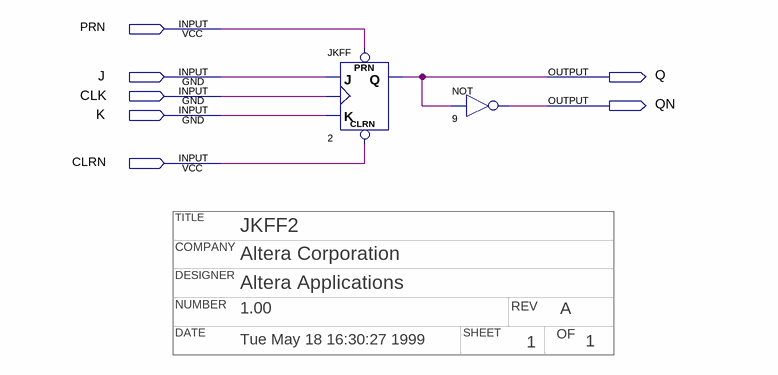
[diagram p0: schematic sheet]
// Quartus schematic jkff2.bdf as structural Verilog: 2 symbols, 7 pins
// Title block: TITLE: JKFF2; COMPANY: Altera Corporation; DESIGNER: Altera Applications; NUMBER: 1.00; REV: A; DATE: Tue May 18 16:30:27 1999; SHEET: 1; OF: 1
module jkff2 (
  input  PRN,
  input  J,
  input  CLK,
  input  K,
  input  CLRN,
  output Q,
  output QN
);

  JKFF u_2 (.PRN(PRN), .CLRN(CLRN), .K(K), .J(J), .CLK(CLK), .Q(Q));
  not u_9 (QN, Q);
endmodule
